# Altium schematic sheet Digital Port F Default State DIP.SchDoc: PORT F Default State Selection Switch
size A4
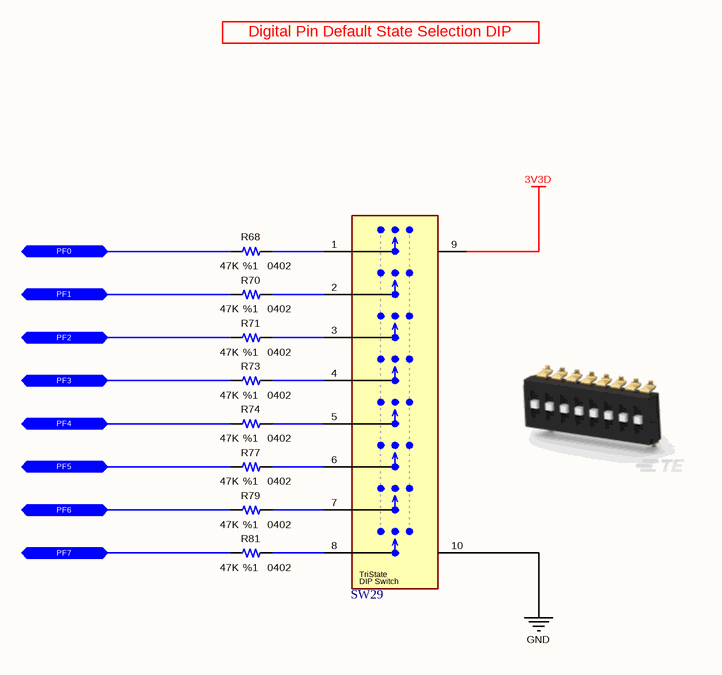
[diagram p0: Digital Port F Default State DIP.SchDoc]

## Parts
R68  value 47K  Tolerance: %1  Case: 0402  [RESISTOR_0402]  (hidden comment: Thick Film Resistor)
R70  value 47K  Tolerance: %1  Case: 0402  [RESISTOR_0402]  (hidden comment: Thick Film Resistor)
R71  value 47K  Tolerance: %1  Case: 0402  [RESISTOR_0402]  (hidden comment: Thick Film Resistor)
R73  value 47K  Tolerance: %1  Case: 0402  [RESISTOR_0402]  (hidden comment: Thick Film Resistor)
R74  value 47K  Tolerance: %1  Case: 0402  [RESISTOR_0402]  (hidden comment: Thick Film Resistor)
R77  value 47K  Tolerance: %1  Case: 0402  [RESISTOR_0402]  (hidden comment: Thick Film Resistor)
R79  value 47K  Tolerance: %1  Case: 0402  [RESISTOR_0402]  (hidden comment: Thick Film Resistor)
R81  value 47K  Tolerance: %1  Case: 0402  [RESISTOR_0402]  (hidden comment: Thick Film Resistor)
SW29  DIP Switches/SIP Switches  [TDS08SGNNTR04]  (value not drawn)

## Ports
PF0 (bidir), PF1 (bidir), PF2 (bidir), PF3 (bidir), PF4 (bidir), PF5 (bidir), PF6 (bidir), PF7 (bidir)

## Nets
3V3D: SW29.9(VCC)
GND: SW29.10(GND)
PF0: R68.2 ; port PF0
PF1: R70.2 ; port PF1
PF2: R71.2 ; port PF2
PF3: R73.2 ; port PF3
PF4: R74.2 ; port PF4
PF5: R77.2 ; port PF5
PF6: R79.2 ; port PF6
PF7: R81.2 ; port PF7
NetR68_1: R68.1 SW29.1
NetR70_1: R70.1 SW29.2
NetR71_1: R71.1 SW29.3
NetR73_1: R73.1 SW29.4
NetR74_1: R74.1 SW29.5
NetR77_1: R77.1 SW29.6
NetR79_1: R79.1 SW29.7
NetR81_1: R81.1 SW29.8

## Notes on the sheet
- Digital Pin Default State Selection DIP
- Title
- Size:
- Date:
- A4
- Number:
- Time:
- Revision:
- Sheet
- of
- File:
- (in symbol Switch - DIP Switch (8 Pole TriState)) TriState; DIP Switch

## Library data of the parts
R68 R70 R71 R73 R74 R77 R79 R81 = Resistor - 47K: Thick Film Resistors - SMD 1/16 W 47 Kohms 1%; Manufacturer Name: Vishay; Manufacturer Part Number: CRCW040247K0FKED; Height: 0.4mm; Mouser Part Number: 71-CRCW0402-47K-E3; ComponentLink1Description: DataSheet; ComponentLink1URL: https://www.mouser.com.tr/datasheet/2/427/dcrcwe3-1762152.pdf; ComponentLink2Description: Mouser; ComponentLink2URL: https://www.mouser.com.tr/ProductDetail/Vishay-Dale/CRCW040247K0FKED?qs=sGAEpiMZZMu61qfTUdNhG2DpbjADlD3GL%252B3h1elTxqU%3D; Supplier 1: Mouser; Supplier 2: Digi-Key; Supplier Part Number 1: 71-CRCW040247K0FKEDH; Supplier Part Number 2: 541-47.0KYCT-ND
SW29 = Switch - DIP Switch (8 Pole TriState): DIP Switches/SIP Switches TRI-STATE DIP 8P G RAISED T&R; Manufacturer Name: TE Connectivity; Manufacturer Part Number: TDS08SGNNTR04; Mouser Part Number: 506-TDS08SGNNTR04; ComponentLink1Description: DataSheet; ComponentLink1URL: https://www.mouser.com.tr/datasheet/2/418/4/NG_DS_1-1773931-8_ALCOSWITCH_DIP_TDS_0917-1221113.pdf; ComponentLink2Description: Mouser; ComponentLink2URL: https://www.mouser.com.tr/ProductDetail/TE-Connectivity-Alcoswitch/TDS08SGNNTR04/?qs=wd5RIQLrsJiLOOX2pWoyQw==